# Altium schematic sheet SAMC21_Xplained_Pro_Peripherals.SchDoc: Arduino Uno interface connectors
size A3; Organization: ATMEL Norway; Address1: Vestre Rosten 79; Address2: N-7075 TILLER; Address3: NORWAY; DocumentNumber: A09-2419; Revision: 5; SheetNumber: 8; SheetTotal: 9; PageSetup: Record=PageOptions|CenterHorizontal=True|CenterVertical=True|PrintScale=1.01|XCorrection=1.00|YCorrection=1.00|PrintKind=1|BorderSize=5000000|LeftOffset=0|BottomOffset=0|Orientation=2|PaperLength=1000|PaperWidth=1000|Scale=100|PaperSource=7|PrintQuality=-4|MediaType=1|DitherType=10|PaperKind=A3 (297 x 420 mm)|PrintScaleMode=1
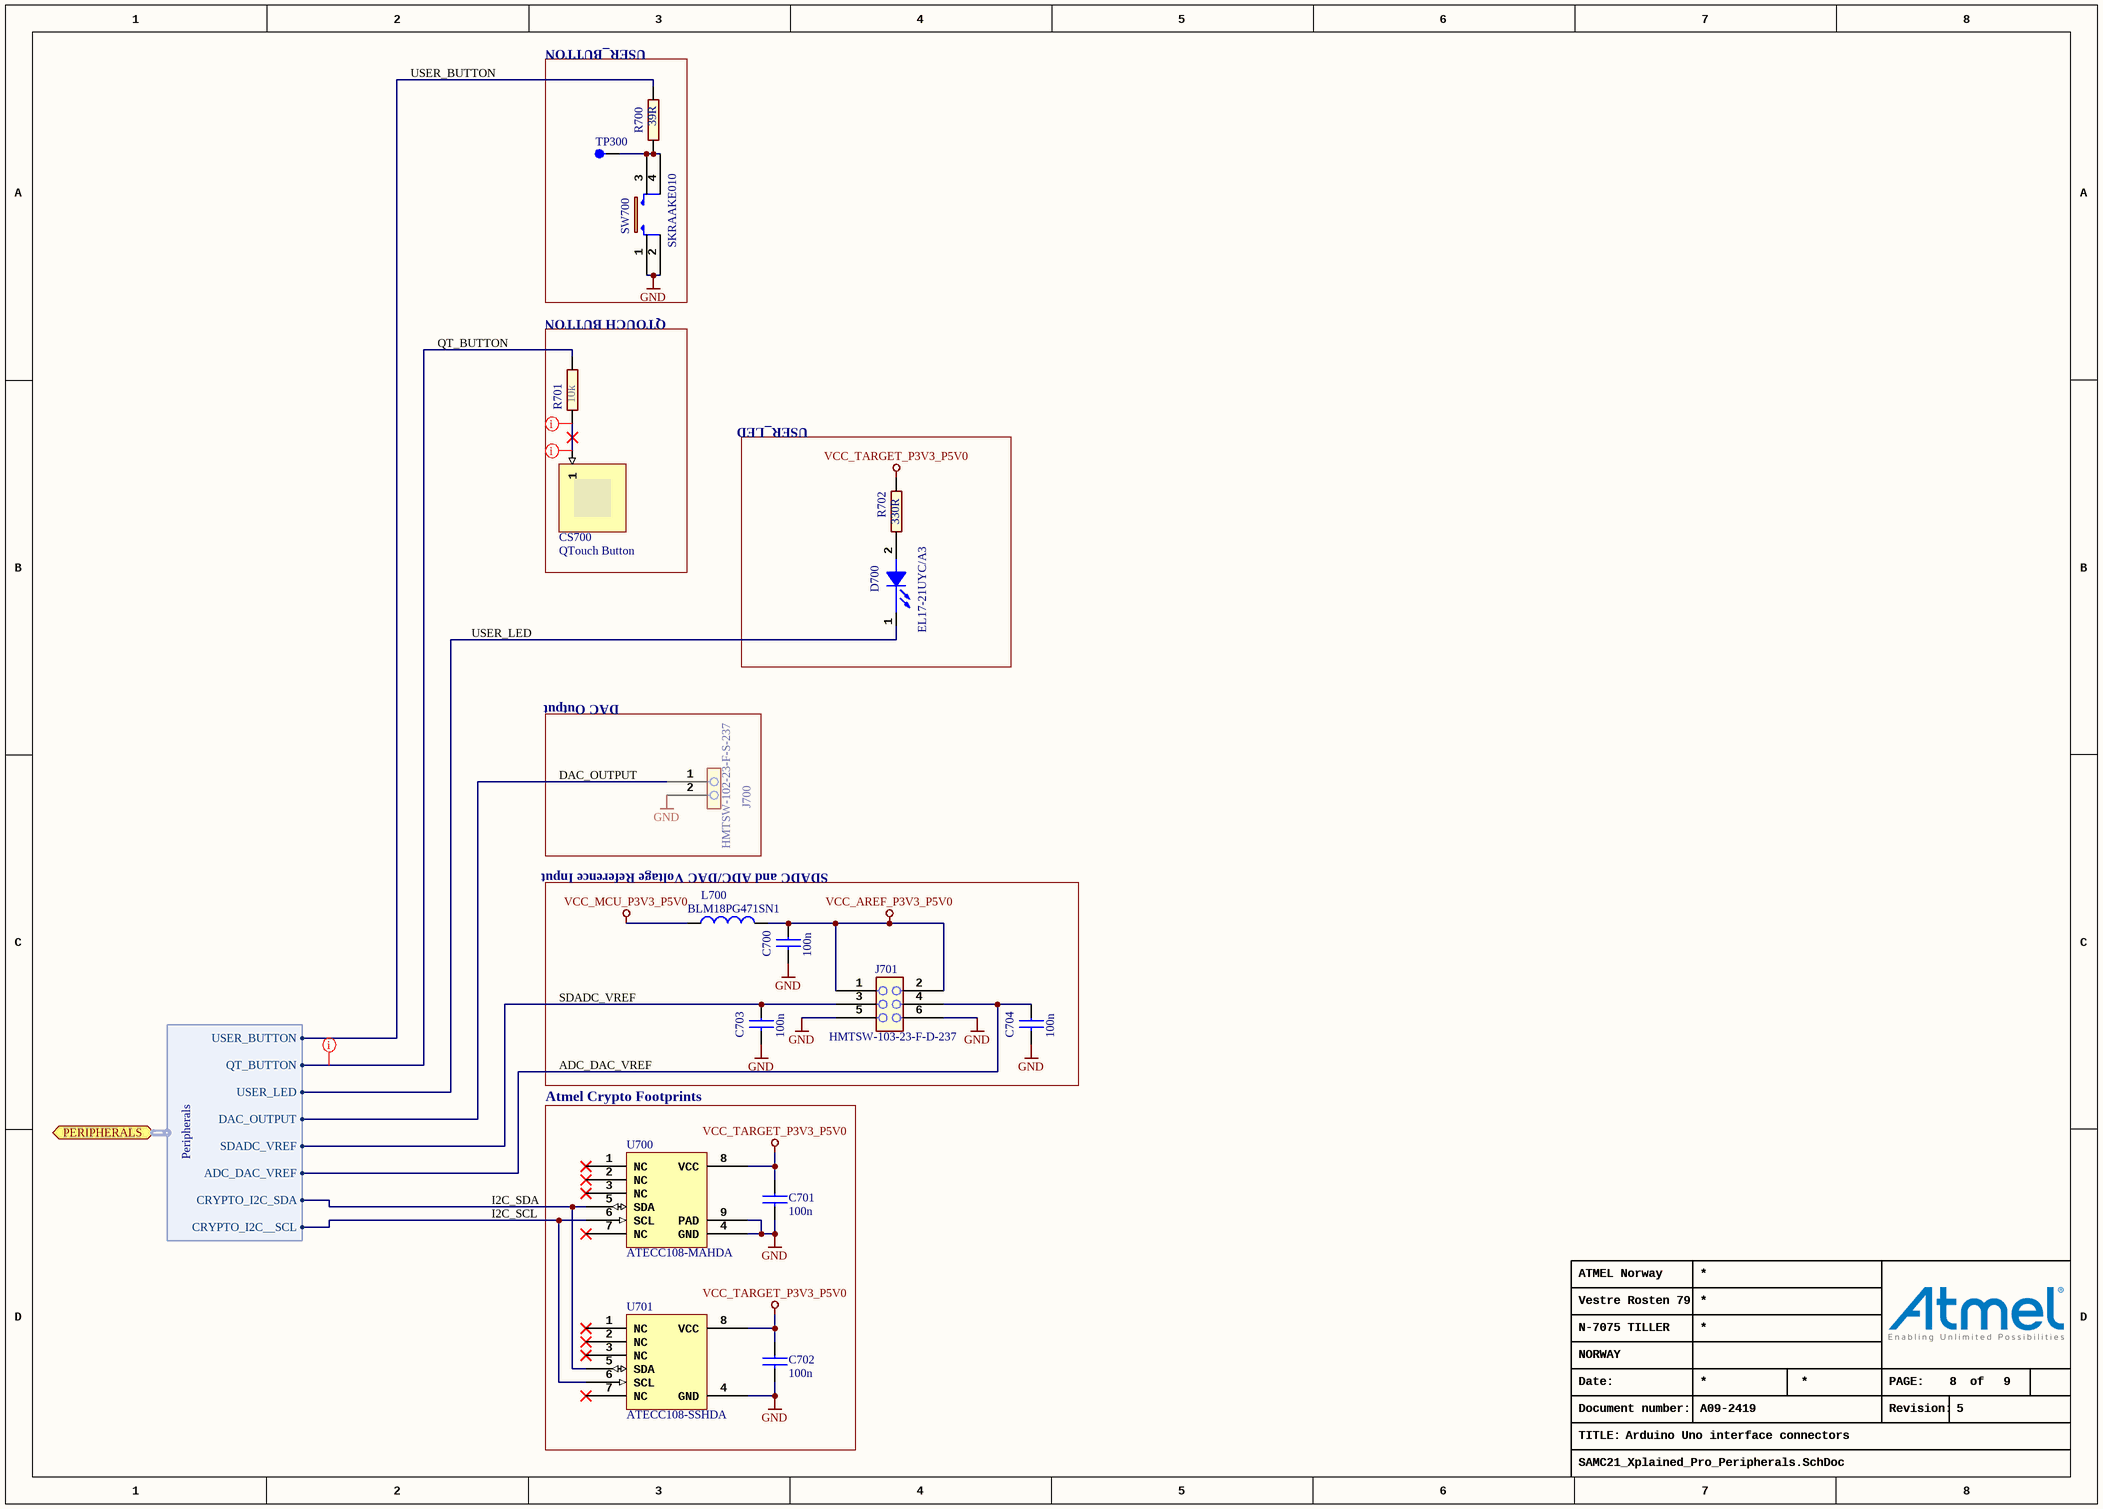
[diagram p0: SAMC21_Xplained_Pro_Peripherals.SchDoc]

## Parts
C700  value 100n  [AP1-00001]
C701  value 100n  [AP1-00001]
C702  value 100n  [AP1-00001]
C703  value 100n  [AP1-00001]
C704  value 100n  [AP1-00001]
CS700  QTouch Button  (no BOM)
D700  value EL17-21UYC/A3  [AP4-00013]
J700  value HMTSW-102-23-F-S-237  [AP8-00733]
J701  value HMTSW-103-23-F-D-237  [AP8-00182]
L700  value BLM18PG471SN1  [AP3-00005]
R700  value 39R  [AP2-00000]
R701  value 10k  [AP2-00000]
R702  value 330R  [AP2-00000]
SW700  value SKRAAKE010  [AP8-00137]  (hidden comment: same as A08-0091 but less force is needed; Can be ordered in low volumes from Mouser)
TP300  (no value)  [AP8-00010]  (no BOM)
U700  value ATECC108-MAHDA  [AP6-00409]
U701  value ATECC108-SSHDA  [AP6-00071]

## Blocks framed on the sheet
USER_BUTTON: R700 SW700 TP300
QTOUCH BUTTON: CS700 R701
USER_LED: D700 R702
DAC Output: J700
SDADC and ADC/DAC Voltage Reference Input: C700 C703 C704 J701 L700
Atmel Crypto Footprints: C701 C702 U700 U701

## Ports
PERIPHERALS (harness Peripherals)

## Harnesses
Peripherals: DAC_OUTPUT, ADC_DAC_VREF, SDADC_VREF, QT_BUTTON, USER_LED, USER_BUTTON, CRYPTO_I2C__SCL, CRYPTO_I2C_SDA

## Nets
GND: C700.2 C701.2 C702.2 C703.2 C704.2 J700.2 J701.5 J701.6 SW700.1 SW700.2 U700.4(GND) U700.9(PAD) U701.4(GND)
VCC_AREF_P3V3_P5V0: C700.1 J701.1 J701.2 L700.2
VCC_MCU_P3V3_P5V0: L700.1
VCC_TARGET_P3V3_P5V0: C701.1 C702.1 R702.2 U700.8(VCC) U701.8(VCC)
NetC703_1: C703.1 J701.3 ; port PERIPHERALS.SDADC_VREF
NetC704_1: C704.1 J701.4 ; port PERIPHERALS.ADC_DAC_VREF
NetCS700_1: CS700.1 R701.1
NetD700_1: D700.1(CATHODE) ; port PERIPHERALS.USER_LED
NetD700_2: D700.2(ANODE) R702.1
NetJ700_1: J700.1 ; port PERIPHERALS.DAC_OUTPUT
NetR700_1: R700.1 SW700.3 SW700.4 TP300.1
NetR700_2: R700.2 ; port PERIPHERALS.USER_BUTTON
NetR701_2: R701.2 ; port PERIPHERALS.QT_BUTTON
NetU700_5: U700.5(SDA) U701.5(SDA) ; port PERIPHERALS.CRYPTO_I2C_SDA
NetU700_6: U700.6(SCL) U701.6(SCL) ; port PERIPHERALS.CRYPTO_I2C__SCL

Not connected (* = marked no-connect by the designer): U700 1(NC)* 2(NC)* 3(NC)* 7(NC)*; U701 1(NC)* 2(NC)* 3(NC)* 7(NC)*

## Layout directives
net class TOUCH; rule Clearance Constraint [Clearance = 0.6mm]: NetCS700_1
rule Assembly Testpoint Usage [Testpoint - Not Allowed    Multiple - Not Allowed]: NetCS700_1, NetR701_2

## Notes on the sheet
- USER_BUTTON
- QT_BUTTON
- USER_LED
- DAC_OUTPUT
- SDADC_VREF
- ADC_DAC_VREF
- I2C_SDA
- I2C_SCL
- Date:
- PAGE:
- of
- TITLE:
- Document number:
- Revision:

## Library data of the parts
C700-C704 = A01-0246: Ceramic capacitor, SMD 0402, X7R, 16V, +/-10%; PartGroup: Capacitors,Ceramic,SMD 0402; Manufacturer: Kemet; MPN: C0402C104K4RACTU; TemperatureRange: -55 - +125 deg C; AN: A01-0246; Tolerance: 16V, +/-10%; Height: 0,5
CS700 = QTouchButton: ConfiguratorName: ATMEL_TOUCH; ConfigurationParameters: {}__sensorid[1]{}width[8]{}height[8]{}
D700 = A10-0019: LED, Yellow, Wave length=591nm, SMD 0805, ±70°; PartGroup: Opto,LEDs,SMD; Manufacturer: Everlight; MPN: 17-21UYC/S530-A3/TR8; TemperatureRange: -40 to +85 deg C; AN: A10-0019; Height: 1,10000002384186
J700 = A08-1754: 1x2 pin header, 2.54mm pitch, Pin-in-Paste THM; PartGroup: Mechanical devices,Connectors,Pin headers; Manufacturer: SAMTEC; TemperatureRange: - 55 deg C to + 125 deg C; AN: A08-1754; Height: 6,09999990463257; MPN: HMTSW-102-23-F-S-237
J701 = A08-1654: 2x3 pin header, 2.54mm pitch, Pin-in-Paste THM; PartGroup: Mechanical devices,Connectors,Pin headers; Manufacturer: SAMTEC; TemperatureRange: - 55 ï¿½C to + 125 ï¿½C; AN: A08-1654; Height: 6,09999990463257; MPN: HMTSW-103-23-F-D-237
L700 = A03-0035: SMD RF inductor 0603. Z=470Ohm (@100MHz), Max R(dc)=0.65Ohm, Max current=1A; PartGroup: Inductors,EMI; Manufacturer: Murata; Tolerance: ±25%; TemperatureRange: -55°C to +125°C; AN: A03-0035; Height: 0,800000011920929; MPN: BLM18PG471SN1
R700 = A02-0178: Thick film resistor, SMD 0402, 1/16W, 1%; PartGroup: Resistors,SMD,0402 1%; TemperatureRange: -55 - +125 deg C; AN: A02-0178; Tolerance: 1 %; Height: 0,349999994039536
R701 = A02-0236: Thick film resistor, SMD 0402, 1/16W, 1%; PartGroup: Resistors,SMD,0402 1%; Manufacturer: vishay; MPN: CRCW040210K0FKED; TemperatureRange: -55 - +125 deg C; AN: A02-0236; Tolerance: 1 %; Height: 0,349999994039536
R702 = A02-0200: Thick film resistor, SMD 0402, 1/16W, 1%; PartGroup: Resistors,SMD,0402 1%; TemperatureRange: -55 - +125 deg C; AN: A02-0200; Tolerance: 1 %; Height: 0,349999994039536
SW700 = A08-0790: 6.2x6.2 mm SMD tact switch, same as A08-0091 but less force is needed; PartGroup: Mechanical devices,Switches,SMD; Manufacturer: ALPS; TemperatureRange: -30 - +90 deg C; AN: A08-0790; Height: 5,09999990463257; MPN: SKRAAKE010
TP300 = A08-0004: Single SMD testpad; PartGroup: Mechanical devices,Connectors,Test points; AN: A08-0004; Value: TESTPAD; Height: 0
U700 = A06-1181: Secure authentication and product validation device, EEPROM, I2C, 2.0 - 5.5V, UDFN8; PartGroup: Integrated Circuits,Special function,Encryption; Manufacturer: ATMEL; MPN: ATECC108-MAHDA-T; TemperatureRange: -40Â°C to +85Â°C; AN: A06-1181; Height: 0,600000023841858
U701 = A06-1182: Secure authentication and product validation device, EEPROM, I2C, 2.0 - 5.5V, SOIC8; PartGroup: Integrated Circuits,Special function,Encryption; Manufacturer: ATMEL; MPN: ATECC108-SSHDA-T; TemperatureRange: -40Â°C to +85Â°C; AN: A06-1182; Height: 1,75